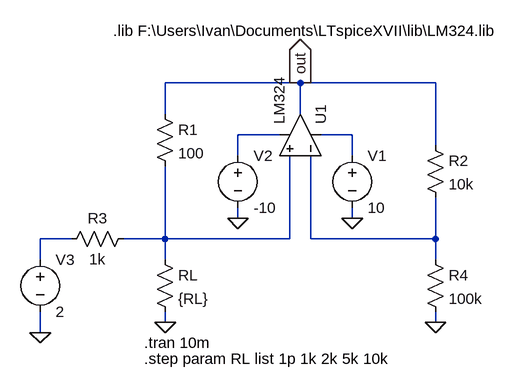
[diagram p0: schematic TP1-Circ2.asc]
TP1-Circ2.asc, the LTspice schematic file:
Version 4
SHEET 1 880 680
WIRE 64 64 -144 64
WIRE 272 64 64 64
WIRE -144 112 -144 64
WIRE 64 112 64 64
WIRE 32 144 -32 144
WIRE 144 144 96 144
WIRE 272 160 272 64
WIRE -32 176 -32 144
WIRE 144 176 144 144
WIRE -32 272 -32 256
WIRE 144 272 144 256
WIRE -288 304 -336 304
WIRE -144 304 -144 192
WIRE -144 304 -208 304
WIRE 48 304 48 176
WIRE 48 304 -144 304
WIRE 80 304 80 176
WIRE 272 304 272 240
WIRE 272 304 80 304
WIRE -336 336 -336 304
WIRE -144 336 -144 304
WIRE 272 336 272 304
WIRE -144 432 -144 416
WIRE 272 432 272 416
WIRE -336 448 -336 416
FLAG 144 272 0
FLAG -32 272 0
FLAG -144 432 0
FLAG 272 432 0
FLAG -336 448 0
FLAG 64 64 out
IOPIN 64 64 Out
SYMBOL res -160 96 R0
SYMATTR InstName R1
SYMATTR Value 100
SYMBOL res 256 144 R0
SYMATTR InstName R2
SYMATTR Value 10k
SYMBOL res -192 288 R90
WINDOW 0 0 56 VBottom 2
WINDOW 3 32 56 VTop 2
SYMATTR InstName R3
SYMATTR Value 1k
SYMBOL res 256 320 R0
SYMATTR InstName R4
SYMATTR Value 100k
SYMBOL voltage 144 160 R0
WINDOW 123 0 0 Left 0
WINDOW 39 0 0 Left 0
SYMATTR InstName V1
SYMATTR Value 10
SYMBOL voltage -32 160 R0
WINDOW 123 0 0 Left 0
WINDOW 39 0 0 Left 0
SYMATTR InstName V2
SYMATTR Value -10
SYMBOL res -160 320 R0
SYMATTR InstName RL
SYMATTR Value {RL}
SYMBOL voltage -336 320 R0
WINDOW 123 0 0 Left 0
WINDOW 39 0 0 Left 0
SYMATTR InstName V3
SYMATTR Value 2
SYMBOL OpAmps\\LM324 64 144 M270
SYMATTR InstName U1
TEXT -224 -16 Left 2 !.lib F:\\Users\\Ivan\\Documents\\LTspiceXVII\\lib\\LM324.lib
TEXT -176 464 Left 2 !.tran 10m
TEXT -176 488 Left 2 !.step param RL list 1p 1k 2k 5k 10k

The netlist it stands for:
* TP1-Circ2.asc
R1 out N004 100
R2 out N005 10k
R3 N004 N003 1k
R4 N005 0 100k
V1 N002 0 10
V2 N001 0 -10
RL N004 0 {RL}
V3 N003 0 2
* U1: LM324 (symbol OpAmps\LM324 not available, pins judged from their places): In+=N004 In-=N005 V+=N002 V-=N001 OUT=out
.lib F:\Users\Ivan\Documents\LTspiceXVII\lib\LM324.lib
.tran 10m
.step param RL list 1p 1k 2k 5k 10k
.backanno
.end